# EAGLE design vibrator_brick (EAGLE 7.2.0)
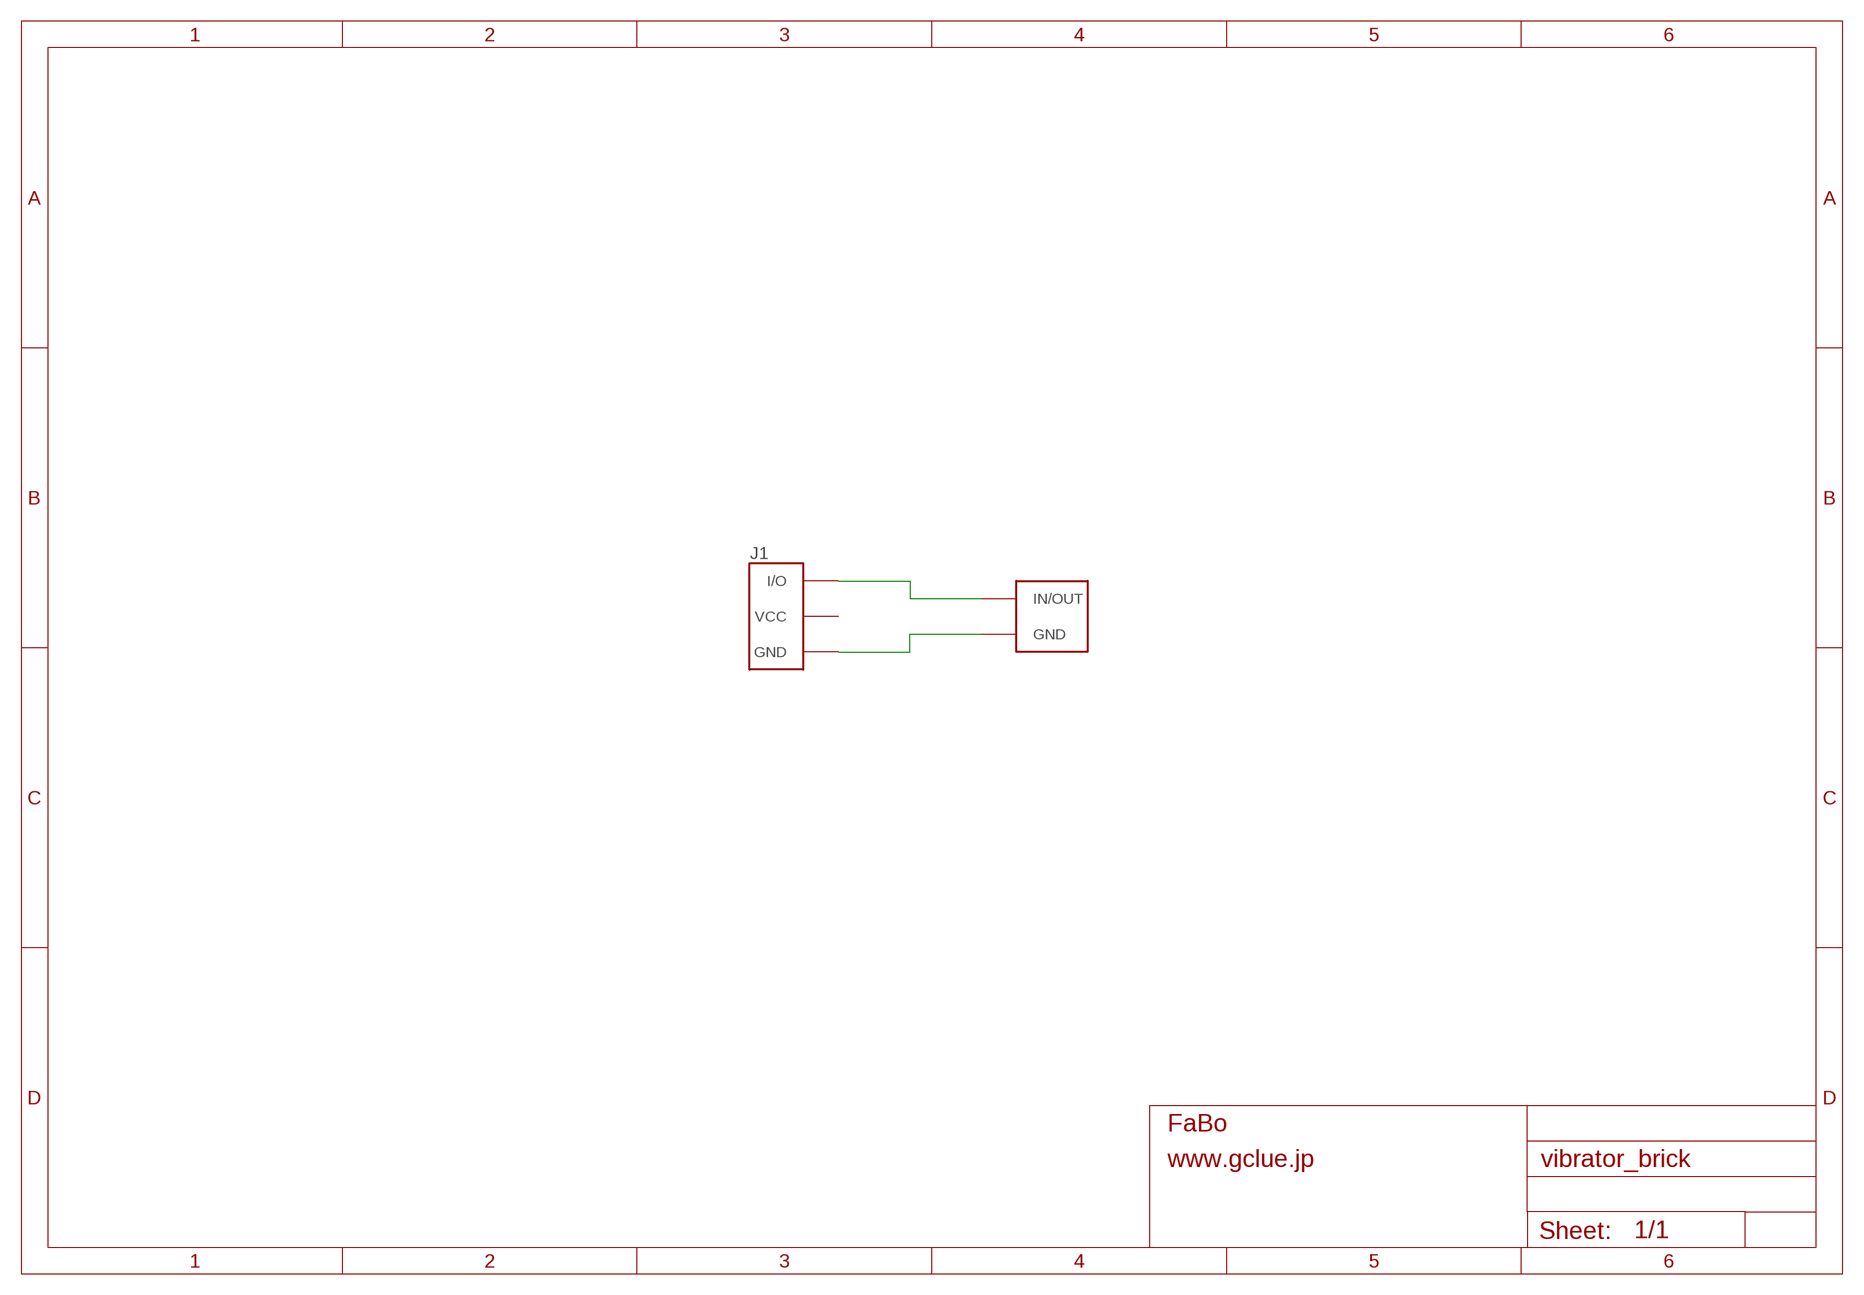
[diagram p0: schematic, sheet 1]

## Parts
J1  BRICK_3PIN  [BRICK_3PIN]
U$1  VIBRATOR-LA3R5-480H1  [VIBRATOR-LA3R5-480H1]

## Nets
GND: J1.GND U$1.P$2(GND)
N$1: J1.IN/OUT(I/O) U$1.P$1(IN/OUT)
Unconnected: J1.VCC

## Library data of the parts
J1 = gclue:BRICK_3PIN: FaBo Brick 3pin
U$1 = gclue:VIBRATOR-LA3R5-480H1

## Board
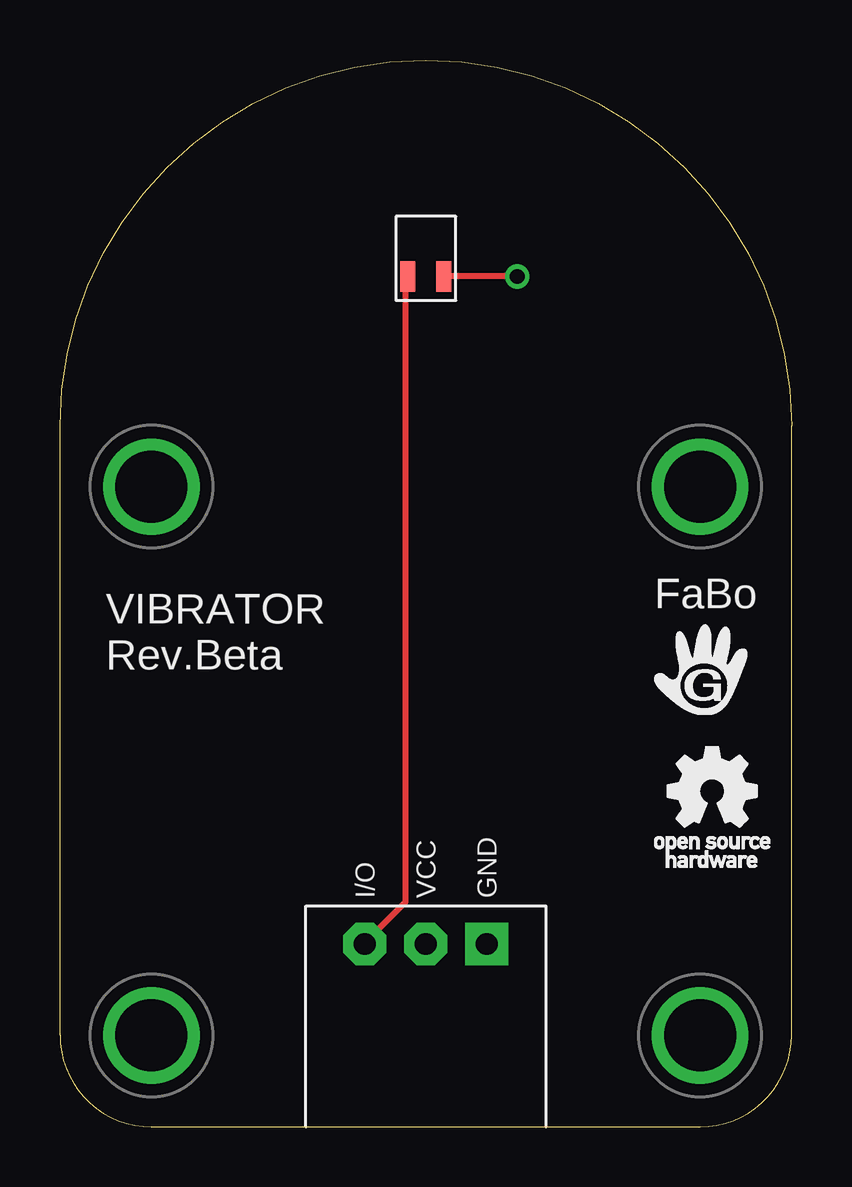
[diagram p1: board, top side]
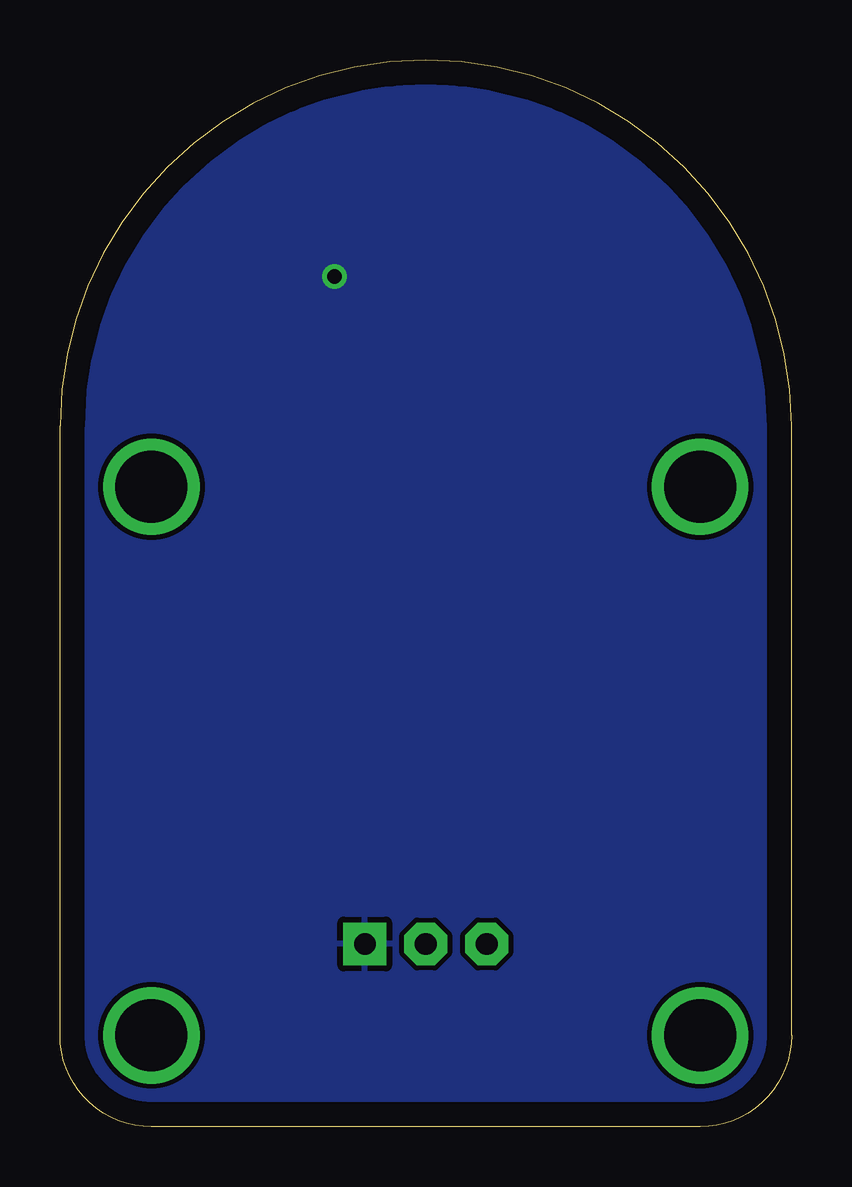
[diagram p2: board, bottom side, seen from below]

Size 30.48 x 44.45 mm. Coordinates in mm from the lower left corner, seen from the top.
Copper layers (1*16): Top 0.035mm / dielectric 1.5mm / Bottom 0.035mm
Design rules "default": minimum track width 10mil, minimum drill 24mil, track to track 8mil, track to pad 8mil, pad to pad 8mil, via to via 8mil, smd to smd 8mil, copper to edge 40mil, drill to drill 8mil, minimum pad ring 10mil, minimum via ring 8mil, stop-mask expansion 4mil, vias tented up to drill 0mil, thermal gap 10mil

### Footprints (pad centres in the part's own frame; a part is rotated, then mirrored left to right if it is on the bottom)
BRICK_3PIN = drill 0.9 pad 1.778 square: GND 2.54,-11.43 | drill 0.9 pad 1.778 octagon: IN/OUT -2.54,-11.43; VCC 0,-11.43 | drill 3 pad 3.81: P$1 -11.43,7.62; P$2 11.43,7.62; P$3 11.43,-15.24; P$4 -11.43,-15.24
VIBRATOR-LA3R5-480H1 = smd 0.635 x 1.27: P$1 -1,-1.27; P$2 0.5,-1.27

### Placement (x,y rotation side)
J1  15.24,19.05 0 top
U$1  15.49,36.7 0 top
U$2  [LOGO_GCLUE_M]  26.67,19.05 0 top
U$4  [LOGO_OSHW_T_M]  27.3,13.34 0 top

### Tracks (layer width: path | path; a pad name or v marks a point on that pad's centre or on a via)
GND  (via drill 0.61)
  Top 0.254: v19.05,35.43 U$1.P$2
  pour Bottom: 0,0 31.11,0 31.11,44.45 0,44.45
N$1
  Top 0.254: U$1.P$1 14.4,35.43 14.4,9.37 12.8,7.77 J1.IN/OUT

### Text on the board
tPlace: FaBo | VIBRATOR / Rev.Beta